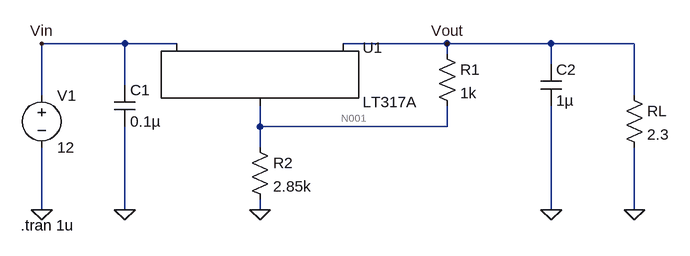
[diagram p0: schematic Draft1.asc]
Draft1.asc, the LTspice schematic file:
Version 4
SHEET 1 880 680
WIRE -64 144 -192 144
WIRE 16 144 -64 144
WIRE 432 144 272 144
WIRE 592 144 432 144
WIRE 720 144 592 144
WIRE 432 160 432 144
WIRE 592 176 592 144
WIRE -64 208 -64 144
WIRE -192 224 -192 144
WIRE 720 224 720 144
WIRE 144 272 144 240
WIRE 432 272 432 240
WIRE 432 272 144 272
WIRE 144 304 144 272
WIRE -192 400 -192 304
WIRE -64 400 -64 272
WIRE 144 400 144 384
WIRE 592 400 592 240
WIRE 720 400 720 304
FLAG -192 400 0
FLAG 720 400 0
FLAG 144 400 0
FLAG -64 400 0
FLAG -192 144 Vin
FLAG 432 144 Vout
FLAG 592 400 0
SYMBOL PowerProducts\\LT317A 144 144 R0
SYMATTR InstName U1
SYMBOL voltage -192 208 R0
SYMATTR InstName V1
SYMATTR Value 12
SYMBOL res 416 144 R0
SYMATTR InstName R1
SYMATTR Value 1k
SYMBOL res 128 288 R0
SYMATTR InstName R2
SYMATTR Value 2.85k
SYMBOL cap -80 208 R0
SYMATTR InstName C1
SYMATTR Value 0.1µ
SYMBOL res 704 208 R0
SYMATTR InstName RL
SYMATTR Value 2.3
SYMBOL cap 576 176 R0
SYMATTR InstName C2
SYMATTR Value 1µ
TEXT -224 424 Left 2 !.tran 1u

The netlist it stands for:
* Draft1.asc
XU1 N001 Vout Vin LT317A
V1 Vin 0 12
R1 Vout N001 1k
R2 N001 0 2.85k
C1 Vin 0 0.1µ
RL Vout 0 2.3
C2 Vout 0 1µ
.tran 1u
.lib LTC.lib
.backanno
.end

* Results of the author's LTspice run, read from the files saved beside the schematic
* Operating Point (first step), zero values left out:
*   rload = 100 m
*   V(vin) = 12 V
*   V(vout) = 5.028 V
*   V(n001) = 3.757 V
*   I(R1) = 1.271 mA
*   I(R2) = 1.318 mA
*   I(Rl) = 2.186 A
*   I(V1) = -2.187 A
*   Ix(u1:1) = -47.49 µA
*   Ix(u1:2) = -2.187 A
*   Ix(u1:3) = 2.187 A